# Altium schematic sheet UART.SchDoc
size A; PageSetup: Record=PageOptions|CenterHorizontal=True|CenterVertical=True|PrintScale=1.07|XCorrection=1.00|YCorrection=1.00|PrintKind=1|BorderSize=5000000|LeftOffset=0|BottomOffset=0|Orientation=2|PaperLength=1000|PaperWidth=1000|Scale=100|PaperSource=257|PrintQuality=600|MediaType=1|DitherType=10|PrintScaleMode=1|PaperKind=Letter|PaperIndex=1
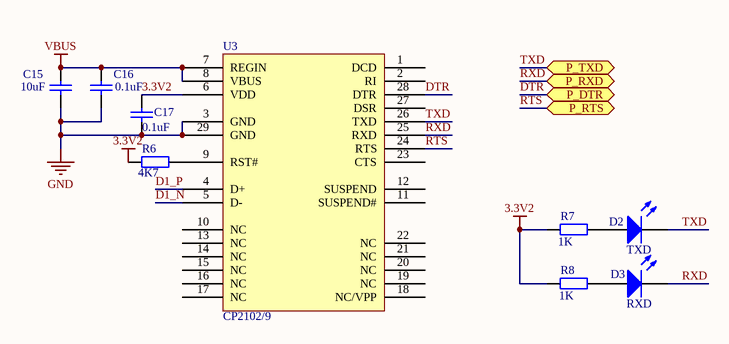
[diagram p0: UART.SchDoc]

## Parts
C15  value 10uF  [C-0603]  (hidden comment: Cap)
C16  value 0.1uF  [C-0603]  (hidden comment: Cap)
C17  value 0.1uF  [C-0603]  (hidden comment: Cap)
D2  TXD  [SMT_LED_0603]
D3  RXD  [SMT_LED_0603]
R6  value 4K7  [0603-1]  (hidden comment: Res2)
R7  value 1K  [0603-1]  (hidden comment: Res2)
R8  value 1K  [0603-1]  (hidden comment: Res2)
U3  CP2102/9  [QFN28-L]

## Ports
P_DTR, P_RTS, P_RXD, P_TXD

## Nets
3.3V2: C17.2 R6.1 R7.1 R8.1 U3.6(VDD)
GND: C15.1 C16.1 C17.1 U3.3(GND) U3.29(GND)
VBUS: C15.2 C16.2 U3.7(REGIN) U3.8(VBUS)
D1_N: U3.5(D-)
D1_P: U3.4(D+)
DTR: U3.28(DTR) ; port P_DTR
RTS: U3.24(RTS) ; port P_RTS
RXD: D3.2(K) U3.25(RXD) ; port P_RXD
TXD: D2.2(K) U3.26(TXD) ; port P_TXD
NetD2_1: D2.1(A) R7.2
NetD3_1: D3.1(A) R8.2
NetR6_2: R6.2 U3.9(RST#)

Not connected (* = marked no-connect by the designer): U3 1(DCD) 2(RI) 10(NC) 11(SUSPEND#) 12(SUSPEND) 13(NC) 14(NC) 15(NC) 16(NC) 17(NC) 18(NC/VPP) 19(NC) 20(NC) 21(NC) 22(NC) 23(CTS) 27(DSR)

## Library data of the parts
C15-C17 = Cap: Capacitor; Published: 8-Jun-2000; LatestRevisionDate: 17-Jul-2002; LatestRevisionNote: Re-released for DXP Platform.; PackageReference: RAD-0.3; Publisher: Altium Limited; PackageDescription: Radial Cap, Thru-Hole; 2 Leads; 0.3 in Pin Spacing
D2 D3 = LED2: Typical RED, GREEN, YELLOW, AMBER GaAs LED; Published: 8-Jun-2000; LatestRevisionDate: 17-Jul-2002; LatestRevisionNote: Re-released for DXP Platform.; PackageVersion: Feb-2002; PackageReference: 3.2X1.6X1.1; Publisher: Altium Limited; PackageDescription: SM LED; 2 Flat Leads
R6-R8 = Res2: Resistor; Published: 8-Jun-2000; LatestRevisionDate: 17-Jul-2002; LatestRevisionNote: Re-released for DXP Platform.; PackageReference: AXIAL-0.4; Publisher: Altium Limited; PackageDescription: Axial Device, Thru-Hole; 2 Leads; 0.4 in Pin Spacing